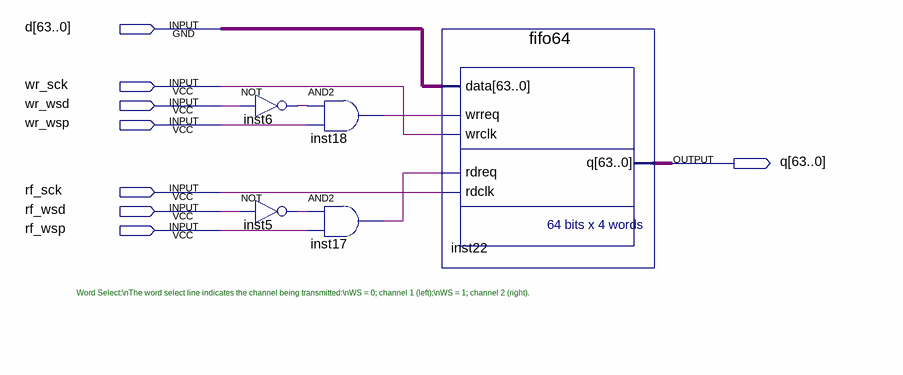
[diagram p0: schematic sheet]
// Quartus schematic i2s_fifo.bdf as structural Verilog: 5 symbols, 8 pins
module i2s_fifo (
  input  [63:0] d,
  input  wr_sck,
  input  wr_wsd,
  input  wr_wsp,
  input  rf_sck,
  input  rf_wsd,
  input  rf_wsp,
  output [63:0] q
);

  wire inst5_out, inst6_out, inst17_out, inst18_out;

  not inst6 (inst6_out, wr_wsd);
  not inst5 (inst5_out, rf_wsd);
  and inst18 (inst18_out, inst6_out, wr_wsp);
  and inst17 (inst17_out, inst5_out, rf_wsp);
  fifo64 inst22 (.data(d), .wrreq(inst18_out), .wrclk(wr_sck), .rdreq(inst17_out), .rdclk(rf_sck), .q(q));

  // Notes on the sheet:
  //   Word Select:\nThe word select line indicates the channel being transmitted:\nWS = 0; channel 1 (left);\nWS = 1; channel 2 (right).
endmodule
